# EAGLE design NodeArch (EAGLE 8.5.2)
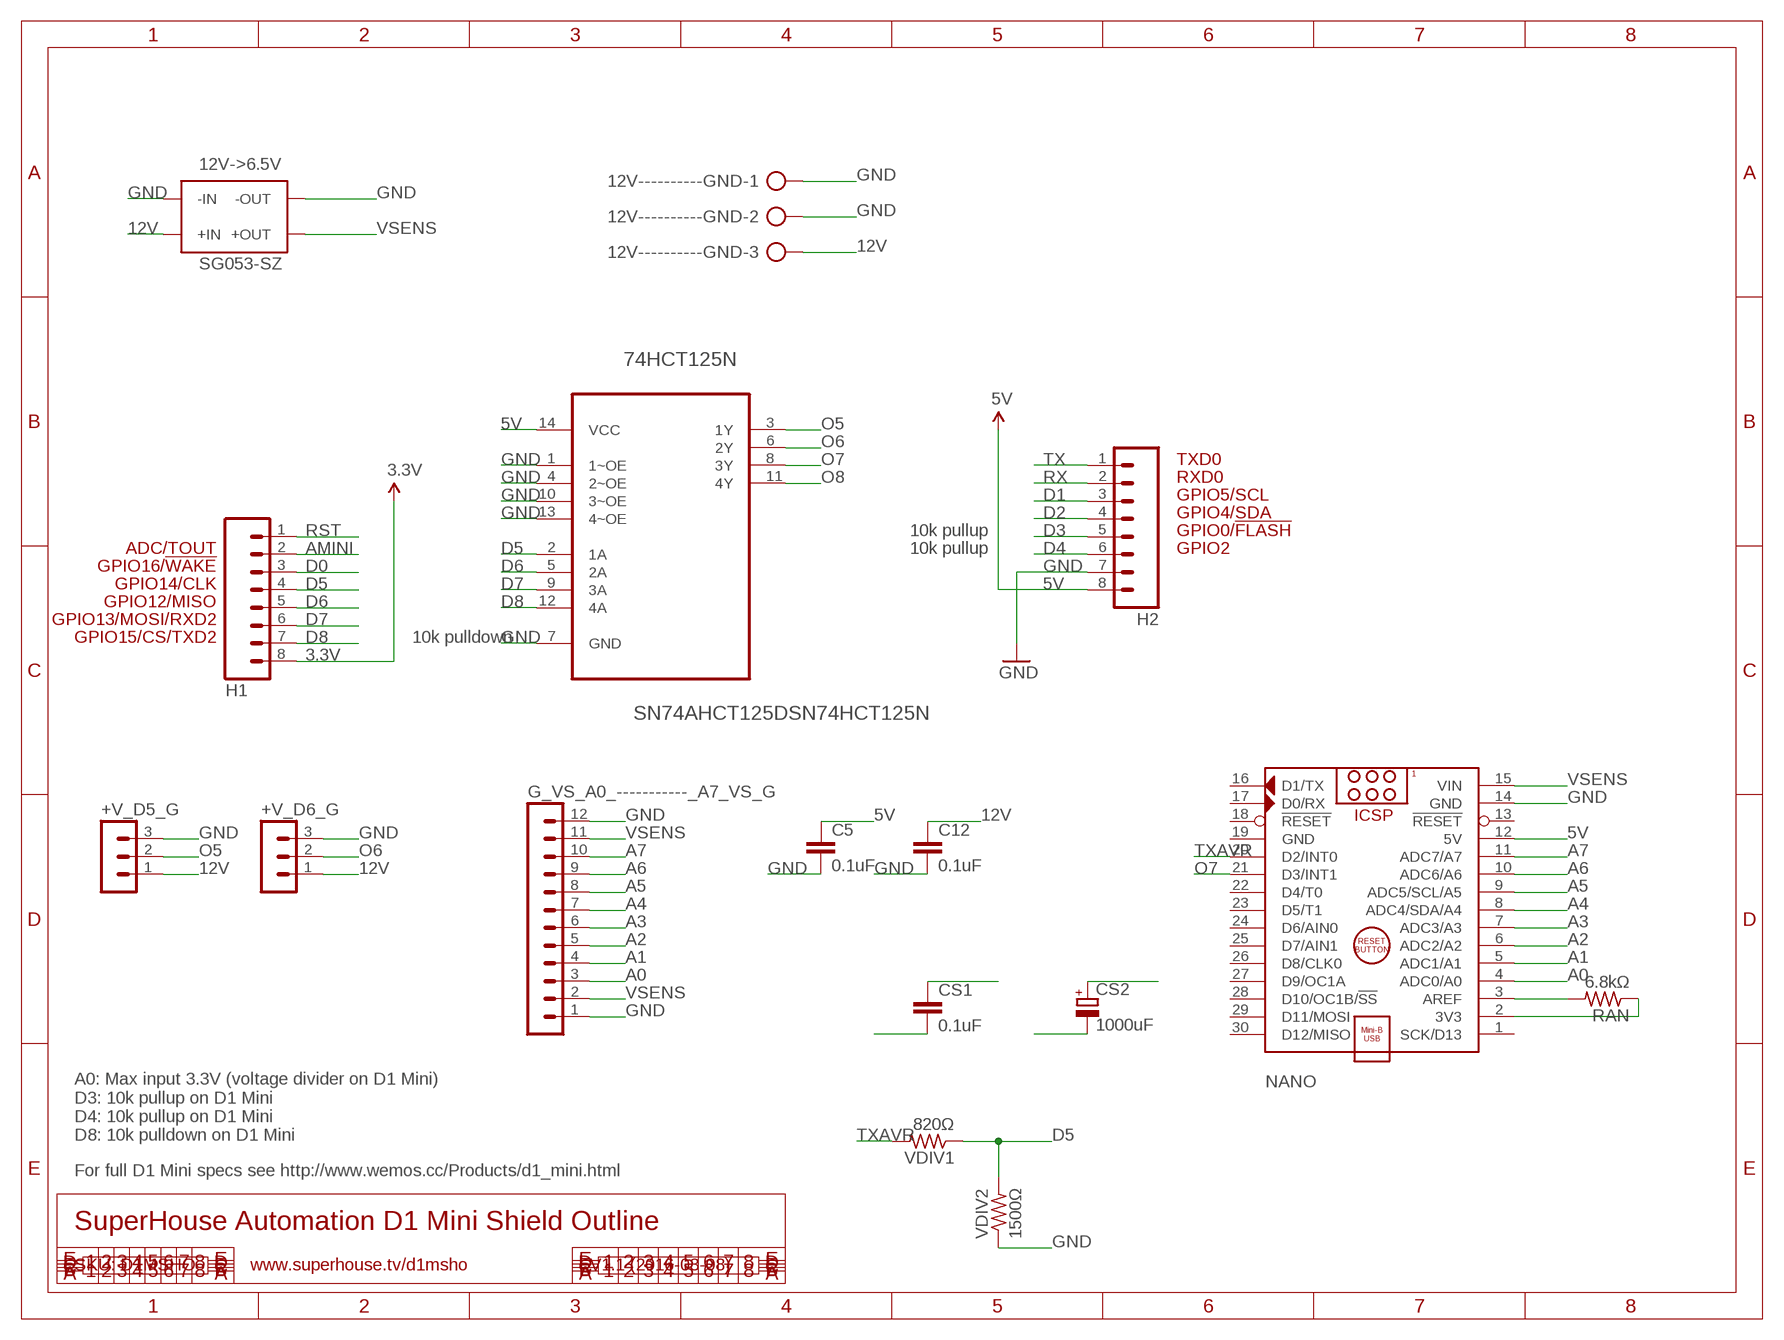
[diagram p0: schematic, sheet 1]

## Parts
12V----------GND  AK500/3  [AK500/3]
12V->6.5V  SG053-SZ  [SG053-SZ]
74HCT125N  SN74AHCT125DSN74HCT125N  [DIP254P762X508-14]
+V_D5_G  MA03-1  [MA03-1]
+V_D6_G  MA03-1  [MA03-1]
C5  0.1uF  C-EU025-025X050  [C025-025X050]
C12  0.1uF  C-EU025-025X050  [C025-025X050]
CS1  0.1uF  C-EU025-025X050  [C025-025X050]
CS2  1000uF  CPOL-EUE5-10.5  [E5-10,5]
G_VS_A0_-----------_A7_VS_G  MA12-1  [MA12-1]
H1  M08  [1X08]
H2  M08  [1X08]
NANO  ARDUINO_NANO  [ARDUINO_NANO]
RAN  6.8kΩ  R-US_0207/2V  [0207/2V]
VDIV1  820Ω  R-US_0207/2V  [0207/2V]
VDIV2  1500Ω  R-US_0207/2V  [0207/2V]

## Nets
3.3V: H1.8
5V: 74HCT125N.14(VCC) C5.1 H2.8 NANO.12(5V)
12V: 12V----------GND.3 12V->6.5V.P$3(+IN) 12V->6.5V.P$4(+IN) +V_D5_G.1 +V_D6_G.1 C12.1
A0: G_VS_A0_-----------_A7_VS_G.3 NANO.4(ADC0/A0)
A1: G_VS_A0_-----------_A7_VS_G.4 NANO.5(ADC1/A1)
A2: G_VS_A0_-----------_A7_VS_G.5 NANO.6(ADC2/A2)
A3: G_VS_A0_-----------_A7_VS_G.6 NANO.7(ADC3/A3)
A4: G_VS_A0_-----------_A7_VS_G.7 NANO.8(ADC4/SDA/A4)
A5: G_VS_A0_-----------_A7_VS_G.8 NANO.9(ADC5/SCL/A5)
A6: G_VS_A0_-----------_A7_VS_G.9 NANO.10(ADC6/A6)
A7: G_VS_A0_-----------_A7_VS_G.10 NANO.11(ADC7/A7)
AMINI: H1.2
D0: H1.3
D1: H2.3
D2: H2.4
D3: H2.5
D4: H2.6
D5: 74HCT125N.2(1A) H1.4 VDIV1.1 VDIV2.2
D6: 74HCT125N.5(2A) H1.5
D7: 74HCT125N.9(3A) H1.6
D8: 74HCT125N.12(4A) H1.7
GND [power]: 12V----------GND.1 12V----------GND.2 12V->6.5V.P$1(-IN) 12V->6.5V.P$2(-IN) 12V->6.5V.P$7(-OUT) 12V->6.5V.P$8(-OUT) 74HCT125N.1(1~OE) 74HCT125N.4(2~OE) 74HCT125N.7(GND) 74HCT125N.10(3~OE) 74HCT125N.13(4~OE) +V_D5_G.3 +V_D6_G.3 C5.2 C12.2 CS1.2 CS2.- G_VS_A0_-----------_A7_VS_G.1 G_VS_A0_-----------_A7_VS_G.12 H2.7 NANO.14(GND) VDIV2.1
N$1: NANO.3(AREF) RAN.2
N$2: NANO.2(3V3) RAN.1
O5: 74HCT125N.3(1Y) +V_D5_G.2
O6: 74HCT125N.6(2Y) +V_D6_G.2
O7: 74HCT125N.8(3Y) NANO.21(D3/INT1)
O8: 74HCT125N.11(4Y)
RST: H1.1
RX: H2.2
TX: H2.1
TXAVR: NANO.20(D2/INT0) VDIV1.2
VSENS: 12V->6.5V.P$5(+OUT) 12V->6.5V.P$6(+OUT) CS1.1 CS2.+ G_VS_A0_-----------_A7_VS_G.2 G_VS_A0_-----------_A7_VS_G.11 NANO.15(VIN)
Unconnected: NANO.1(SCK/D13) NANO.13(!RESET) NANO.16(D1/TX) NANO.17(D0/RX) NANO.18(!RESET) NANO.22(D4/T0) NANO.23(D5/T1) NANO.24(D6/AIN0) NANO.25(D7/AIN1) NANO.26(D8/CLK0) NANO.27(D9/OC1A) NANO.28(D10/OC1B/!SS) NANO.29(D11/MOSI) NANO.30(D12/MISO)

## Notes on the sheet
- TXD0
- RXD0
- GPIO5/SCL
- GPIO4/SDA
- 10k pullup | GPIO0/!FLASH
- ADC/TOUT | 10k pullup | GPIO2
- GPIO16/!WAKE
- GPIO14/CLK
- GPIO12/MISO
- GPIO13/MOSI/RXD2
- GPIO15/CS/TXD2 | 10k pulldown
- A0: Max input 3.3V (voltage divider on D1 Mini)
  D3: 10k pullup on D1 Mini
  D4: 10k pullup on D1 Mini
  D8: 10k pulldown on D1 Mini
- For full D1 Mini specs see http://www.wemos.cc/Products/d1_mini.html
- SuperHouse Automation D1 Mini Shield Outline
- SKU: D1MSHO | www.superhouse.tv/d1msho | V1.1 (2016-03-08)

## Power pins joined to a net without a drawn wire
GND: NANO.19(GND)

## Library data of the parts
12V----------GND = con-ptr500:AK500/3: CONNECTOR; OC_FARNELL: unknown; OC_NEWARK: unknown
12V->6.5V = 1484249208697-powermodules:SG053-SZ
74HCT125N = parts:SN74AHCT125D: QUADRUPLE BUS BUFFER GATES WITH 3-STATE OUTPUTS
+V_D5_G +V_D6_G = con-lstb:MA03-1: PIN HEADER; OC_FARNELL: unknown; OC_NEWARK: unknown
C5 C12 CS1 = rcl:C-EU: CAPACITOR, European symbol; SPICEPREFIX: C
CS2 = resistor:CPOL-EU: POLARIZED CAPACITOR, European symbol
G_VS_A0_-----------_A7_VS_G = con-lstb:MA12-1: PIN HEADER; OC_FARNELL: unknown; OC_NEWARK: unknown
H1 H2 = freetronics-original:M08: Header 8 Standard 8-pin 0.1" header. Use with straight break away headers (SKU : PRT-00116), right angle break away headers (PRT-00553), swiss pins (PRT-00743), machine pins (PRT-00117), and female headers (PRT-00115).
NANO = ArduinoNanoV30:ARDUINO_NANO: Arduino Nano V3.0 Module Overview: The Arduino Nano is a small, complete, and breadboard-friendly board based on the ATmega328 (Arduino Nano 3.x) or ATmega168 (Arduino Nano 2.x). It has more or less the same functionality of the Arduino Duemilanove, but in a different package. It lacks only a DC power jack, and works with a Mini-B USB cable instead of a standard one. The Nano was designed and is being produced by Gravitech <http://www.gravitech.us/arna30wiatp.html>. General specifications: Item Value Microcontroller Atmel ATmega168 or ATmega328 Operating Voltage (logic level) 5 V Input Voltage (recommended) 7-12 V Input Voltage (limits) 6-20 V Digital I/O Pins 14 (of which 6 provide PWM output) Analog Input Pins 8 DC Current per I/O Pin 40 mA Flash Memory 16 KB (ATmega168) or 32 KB (ATmega328) of which 2 KB used by bootloader SRAM 1 KB (ATmega168) or 2 KB (ATmega328) EEPROM 512 bytes (ATmega168) or 1 KB (ATmega328) Clock Speed 16 MHz Dimensions (Inches) 0.73" x 1.70" Dimensions (mm) 18mm x 45mm Overall height About 9 mm (not including pins) Weigth 5 g Power: The Arduino Nano can be powered via the Mini-B USB connection, 6-20V unregulated external power supply (pin 30), or 5V regulated external power supply (pin 27). The power source is automatically selected to the highest voltage source. Memory: The ATmega168 has 16 KB of flash memory for storing code (of which 2 KB is used for the bootloader); the ATmega328 has 32 KB, (also with 2 KB used for the bootloader). The ATmega168 has 1 KB of SRAM and 512 bytes of EEPROM (which can be read and written with the EEPROM library); the ATmega328 has 2 KB of SRAM and 1 KB of EEPROM. Input and Output: Each of the 14 digital pins on the Nano can be used as an input or output, using pinMode(), digitalWrite(), and digitalRead() functions. They operate at 5 volts. Each pin can provide or receive a maximum of 40 mA and has an internal pull-up resistor (disconnected by default) of 20-50 kOhms. In addition, some pins have specialized functions. Visit Arduino - ArduinoBoardNano <https://www.arduino.cc/en/Main/ArduinoBoardNano>
RAN VDIV1 VDIV2 = resistor:R-US_: RESISTOR, American symbol

## Net classes
0 default: width 0.203 mm, drill 0.356 mm, clearance 0.152 mm
1 power: width 0.203 mm, clearance 0.152 mm

## Board
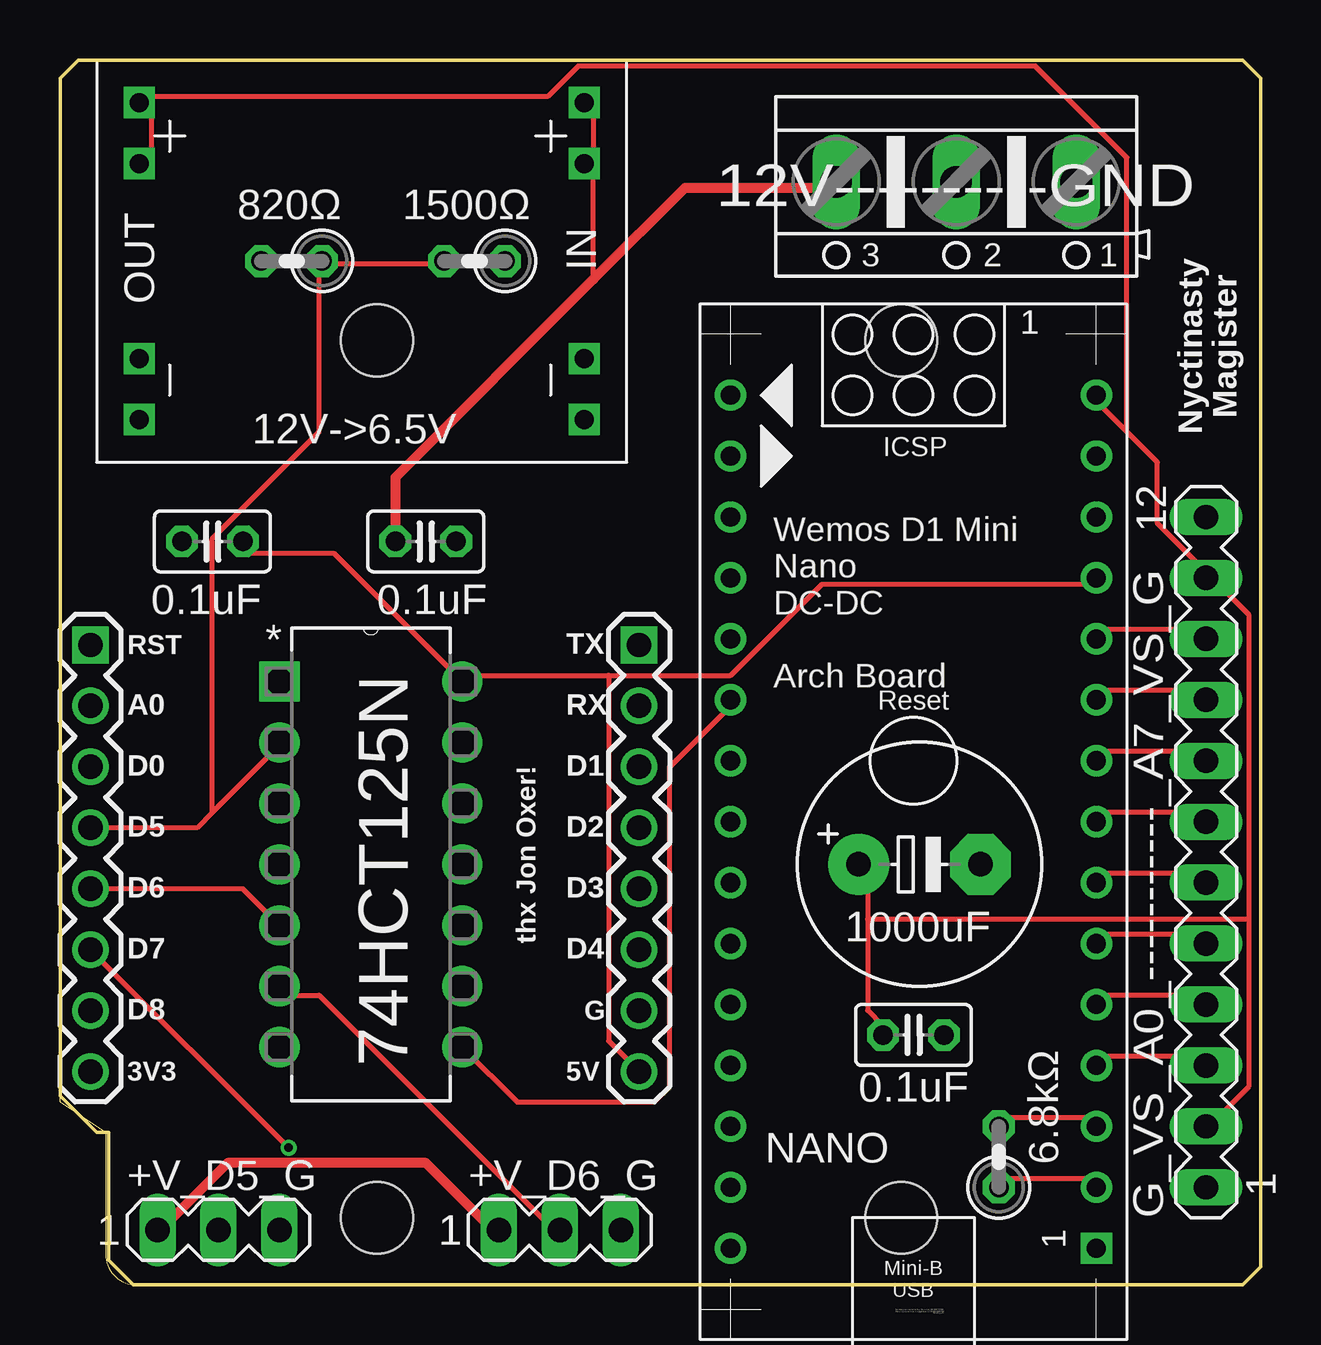
[diagram p1: board, top side]
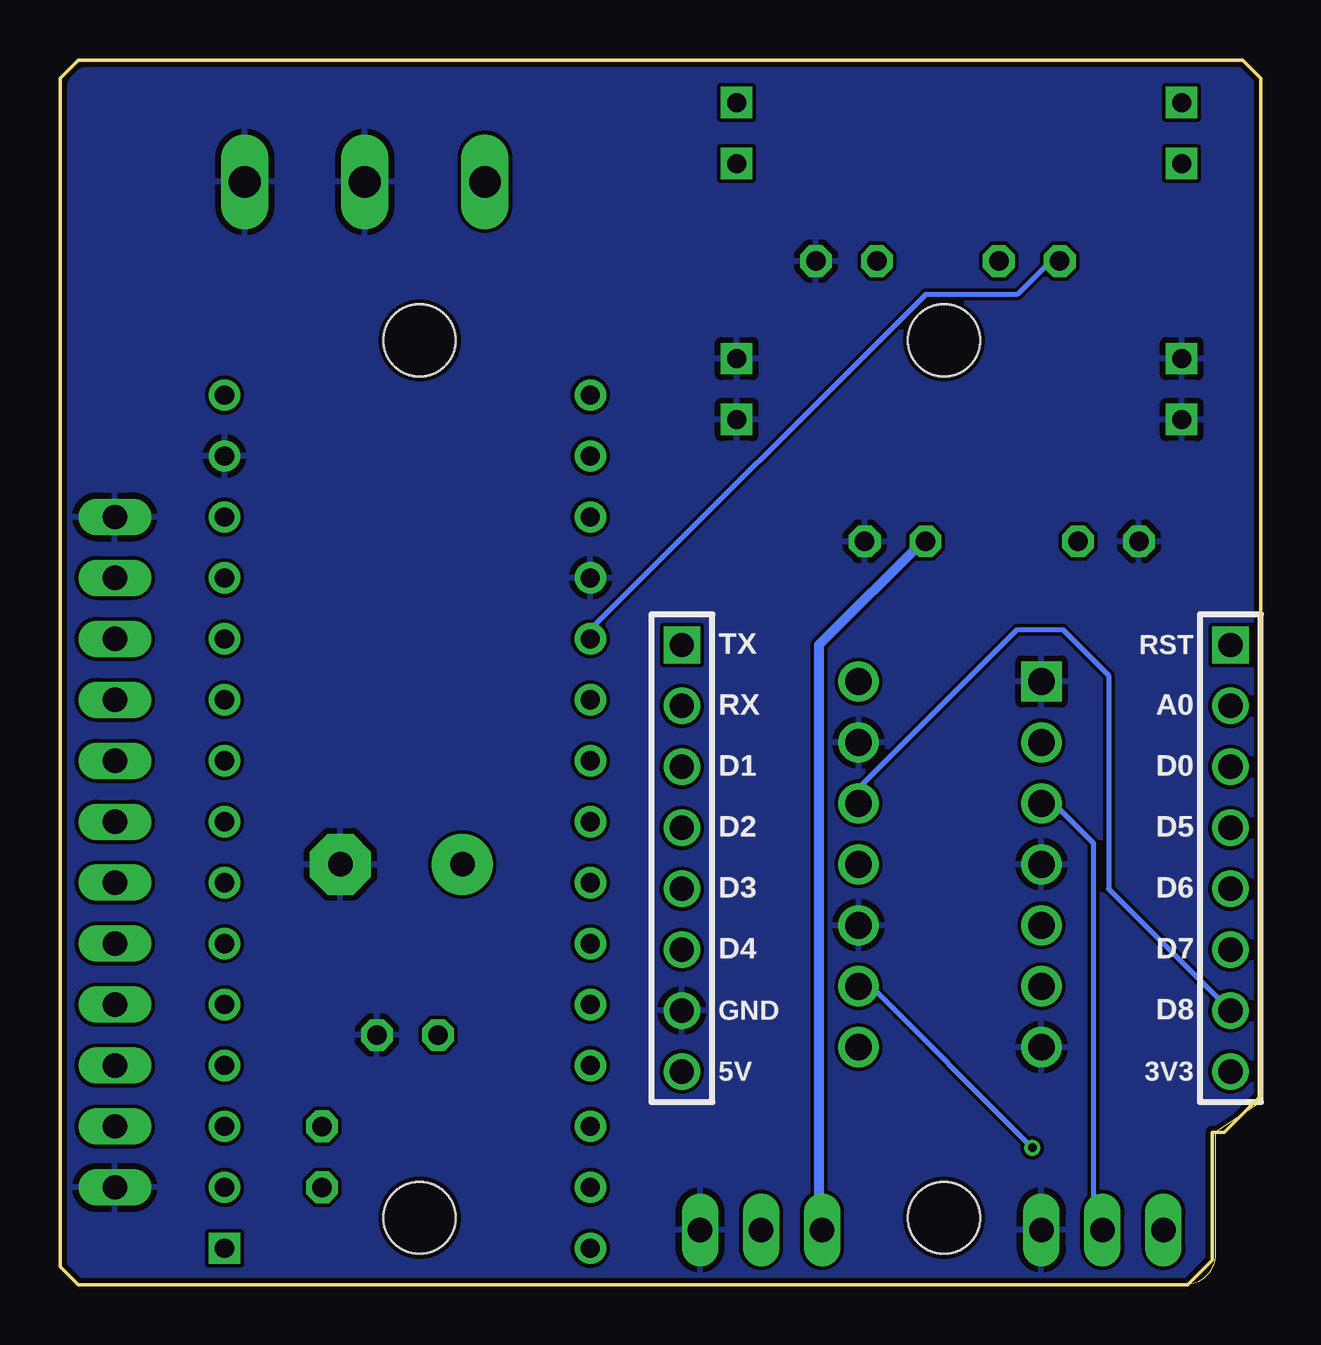
[diagram p2: board, bottom side, seen from below]

Size 50.04 x 51.05 mm. Coordinates in mm from the lower left corner, seen from the top.
Outline: 24.13,0 3.17,0 arc-90 1.91,1.27 1.91,6.35 0,7.62 0,7.87
Outline: 0,7.87 0,31.75
Outline: 0,7.87 1.52,6.35 2.03,6.35 2.03,1.02 3.05,0 49.28,0 50.04,0.76 50.04,50.29 49.28,51.05 0.76,51.05 0,50.29 0,7.87
Copper layers (1*16): Top 0.035mm / dielectric 1.5mm / Bottom 0.035mm
Design rules "ElectroDragon_2layer_DRU_no_angle_20140221": minimum track width 6mil, minimum drill 12mil, track to track 6mil, track to pad 6mil, pad to pad 6mil, via to via 6mil, smd to smd 6mil, copper to edge 8mil, drill to drill 6mil, minimum pad ring 10mil, minimum via ring 6mil, stop-mask expansion 4mil, vias tented up to drill 100mil, thermal gap 10mil
Holes 3 mm at 13.21,2.79 35.05,2.79 35.05,39.37 13.21,39.37

### Footprints (pad centres in the part's own frame; a part is rotated, then mirrored left to right if it is on the bottom)
AK500/3 = drill 1.321 long: 1 -5.004,0; 2 0,0; 3 5.004,0
SG053-SZ = drill 0.8 square: P$1 -8.382,6.096; P$2 -8.382,3.556; P$3 -8.382,-4.572; P$4 -8.382,-7.112; P$5 10.16,-7.112; P$6 10.16,-4.572; P$7 10.16,3.556; P$8 10.16,6.096
DIP254P762X508-14 = drill 1.118 square: 1 -7.62,15.24 | drill 1.118: 2 -7.62,12.7; 3 -7.62,10.16; 4 -7.62,7.62; 5 -7.62,5.08; 6 -7.62,2.54; 7 -7.62,0; 8 0,0; 9 0,2.54; 10 0,5.08; 11 0,7.62; 12 0,10.16; 13 0,12.7; 14 0,15.24
MA03-1 = drill 1.016 long: 1 -2.54,0; 2 0,0; 3 2.54,0
C025-025X050 = drill 0.813 octagon: 1 -1.27,0; 2 1.27,0
E5-10,5 = drill 1.016 pad 2.54: + -2.54,0 | drill 1.016 pad 2.54 octagon: - 2.54,0
MA12-1 = drill 1.016 long: 1 -13.97,0; 2 -11.43,0; 3 -8.89,0; 4 -6.35,0; 5 -3.81,0; 6 -1.27,0; 7 1.27,0; 8 3.81,0; 9 6.35,0; 10 8.89,0; 11 11.43,0; 12 13.97,0
1X08 = drill 1.016 square: 1 0,0 | drill 1.016: 2 2.54,0; 3 5.08,0; 4 7.62,0; 5 10.16,0; 6 12.7,0; 7 15.24,0; 8 17.78,0
ARDUINO_NANO = drill 0.8 square: 1 -20.32,-7.62 | drill 0.8: 2 -17.78,-7.62; 3 -15.24,-7.62; 4 -12.7,-7.62; 5 -10.16,-7.62; 6 -7.62,-7.62; 7 -5.08,-7.62; 8 -2.54,-7.62; 9 0,-7.62; 10 2.54,-7.62; 11 5.08,-7.62; 12 7.62,-7.62; 13 10.16,-7.62; 14 12.7,-7.62; 15 15.24,-7.62; 16 15.24,7.62; 17 12.7,7.62; 18 10.16,7.62; 19 7.62,7.62; 20 5.08,7.62; 21 2.54,7.62; 22 0,7.62; 23 -2.54,7.62; 24 -5.08,7.62; 25 -7.62,7.62; 26 -10.16,7.62; 27 -12.7,7.62; 28 -15.24,7.62; 29 -17.78,7.62; 30 -20.32,7.62
0207/2V = drill 0.813 octagon: 1 -1.27,0; 2 1.27,0

### Placement (x,y rotation side)
12V----------GND  37.34,45.97 180 top
12V->6.5V  13.46,42.16 180 top
74HCT125N  16.76,9.91 0 top
+V_D5_G  6.6,2.29 0 top
+V_D6_G  20.83,2.29 0 top
C5  6.35,30.99 180 top
C12  15.24,30.99 0 top
CS1  35.56,10.41 0 top
CS2  35.81,17.53 0 top
G_VS_A0_-----------_A7_VS_G  47.75,18.03 90 top
H1  1.27,26.67 270 top
H2  24.13,26.67 270 top
NANO  35.56,21.84 90 top
RAN  39.12,5.33 90 top
VDIV1  9.65,42.67 180 top
VDIV2  17.27,42.67 180 top

### Tracks (layer width: path | path; a pad name or v marks a point on that pad's centre or on a via)
5V
  Top 0.203: 22.86,25.4 17.14,25.4 74HCT125N.14 11.43,30.48 7.62,30.48 C5.1 | 22.86,25.4 27.94,25.4 31.75,29.21 43.18,29.21 NANO.12 | H2.8 22.86,10.16 22.86,25.4
12V
  Top 0.152: 12V----------GND.3 32.08,45.72 | 26.04,45.72 25.91,45.72
  Top 0.203: 4.45,2.54 +V_D5_G.1 | 17.78,2.54 +V_D6_G.1 | 12V->6.5V.P$4 22.23,48.9 22.23,46.99 12V->6.5V.P$3 22.23,46.35 22.23,41.91
  Top 0.406: 32.08,45.72 26.04,45.72 22.23,41.91 13.97,33.66 C12.1 | 4.45,2.54 6.99,5.08 15.24,5.08 17.78,2.54
  Bottom 0.203: 18.41,2.54 +V_D6_G.1 | 13.97,31.11 C12.1
  Bottom 0.406: 18.41,2.54 18.41,26.67 13.97,31.11
A0
  Top 0.203: NANO.4 43.18,9.53 47.62,9.53 G_VS_A0_-----------_A7_VS_G.3
A1
  Top 0.203: NANO.5 43.18,12.06 47.62,12.06 G_VS_A0_-----------_A7_VS_G.4
A2
  Top 0.203: NANO.6 43.18,14.61 47.62,14.61 G_VS_A0_-----------_A7_VS_G.5
A3
  Top 0.203: NANO.7 43.18,17.14 47.62,17.14 G_VS_A0_-----------_A7_VS_G.6
A4
  Top 0.203: NANO.8 43.18,19.68 47.62,19.68 G_VS_A0_-----------_A7_VS_G.7
A5
  Top 0.203: NANO.9 43.18,22.23 47.62,22.23 G_VS_A0_-----------_A7_VS_G.8
A6
  Top 0.203: NANO.10 43.18,24.77 47.62,24.77 G_VS_A0_-----------_A7_VS_G.9
A7
  Top 0.203: NANO.11 43.18,27.3 47.62,27.3 G_VS_A0_-----------_A7_VS_G.10
D5
  Top 0.203: VDIV2.2 15.88,42.55 11.43,42.55 VDIV1.1 10.79,42.55 10.79,35.56 6.35,31.11 6.35,19.68 | H1.4 5.71,19.05 6.35,19.68 | 6.35,19.68 8.89,22.23 74HCT125N.2
D6
  Top 0.203: H1.5 7.62,16.51 74HCT125N.5
D7  (via drill 0.36)
  Top 0.203: v9.53,5.71 H1.6
  Bottom 0.203: v9.53,5.71 16.51,12.7 74HCT125N.9
D8
  Bottom 0.203: H1.7 6.35,16.51 6.35,25.4 8.26,27.3 10.16,27.3 17.14,20.32 74HCT125N.12
GND
  pour Bottom: 49.78,1.02 49.78,49.28 arc90 48.51,50.8 1.27,50.8 arc90 0,49.78 0,7.87 1.91,6.35 1.91,1.27 arc90 3.17,0 48.51,0 arc90
N$1
  Top 0.203: NANO.3 43.18,6.99 39.37,6.99 RAN.2
N$2
  Top 0.203: NANO.2 43.18,4.45 39.37,4.45 RAN.1
O5
  Bottom 0.203: +V_D5_G.2 6.99,2.54 6.99,18.41 8.89,20.32 74HCT125N.3
O6
  Top 0.203: +V_D6_G.2 20.32,2.54 10.79,12.06 9.53,12.06 74HCT125N.6
O7
  Top 0.203: 74HCT125N.8 19.05,7.62 24.77,7.62 25.4,8.26 25.4,21.59 27.94,24.13 NANO.21
TXAVR
  Bottom 0.203: NANO.20 27.94,27.3 13.97,41.27 10.16,41.27 8.89,42.55 VDIV1.2
VSENS
  Top 0.203: 12V->6.5V.P$6 3.81,46.99 3.81,48.9 12V->6.5V.P$5 3.81,49.53 20.32,49.53 21.59,50.8 40.64,50.8 44.45,46.99 44.45,35.56 | 44.45,35.56 45.72,34.29 45.72,31.75 47.62,29.84 G_VS_A0_-----------_A7_VS_G.11 48.26,29.21 49.53,27.94 49.53,15.24 | 44.45,35.56 43.18,36.83 NANO.15 | 49.53,15.24 49.53,8.26 48.26,6.99 G_VS_A0_-----------_A7_VS_G.2 | 33.66,15.24 33.66,17.14 CS2.+ | 33.66,15.24 33.66,11.43 34.29,10.79 CS1.1 | 49.53,15.24 33.66,15.24

### Text on the board
tPlace: Nyctinasty / Magister | Wemos D1 Mini / Nano / DC-DC / / Arch Board | RST | TX | A0 | RX | D0 | D1 | D5 | D2 | D6 | D3 | D7 | thx Jon Oxer! | D4 | D8 | G | 3V3 | 5V
bPlace: RST | TX | A0 | RX | D0 | D1 | D5 | D2 | D6 | D3 | D7 | D4 | D8 | GND | 3V3 | 5V